# Altium schematic sheet Fuel_Gauge.SchDoc
size A4; SheetNumber: 1; SheetTotal: 2
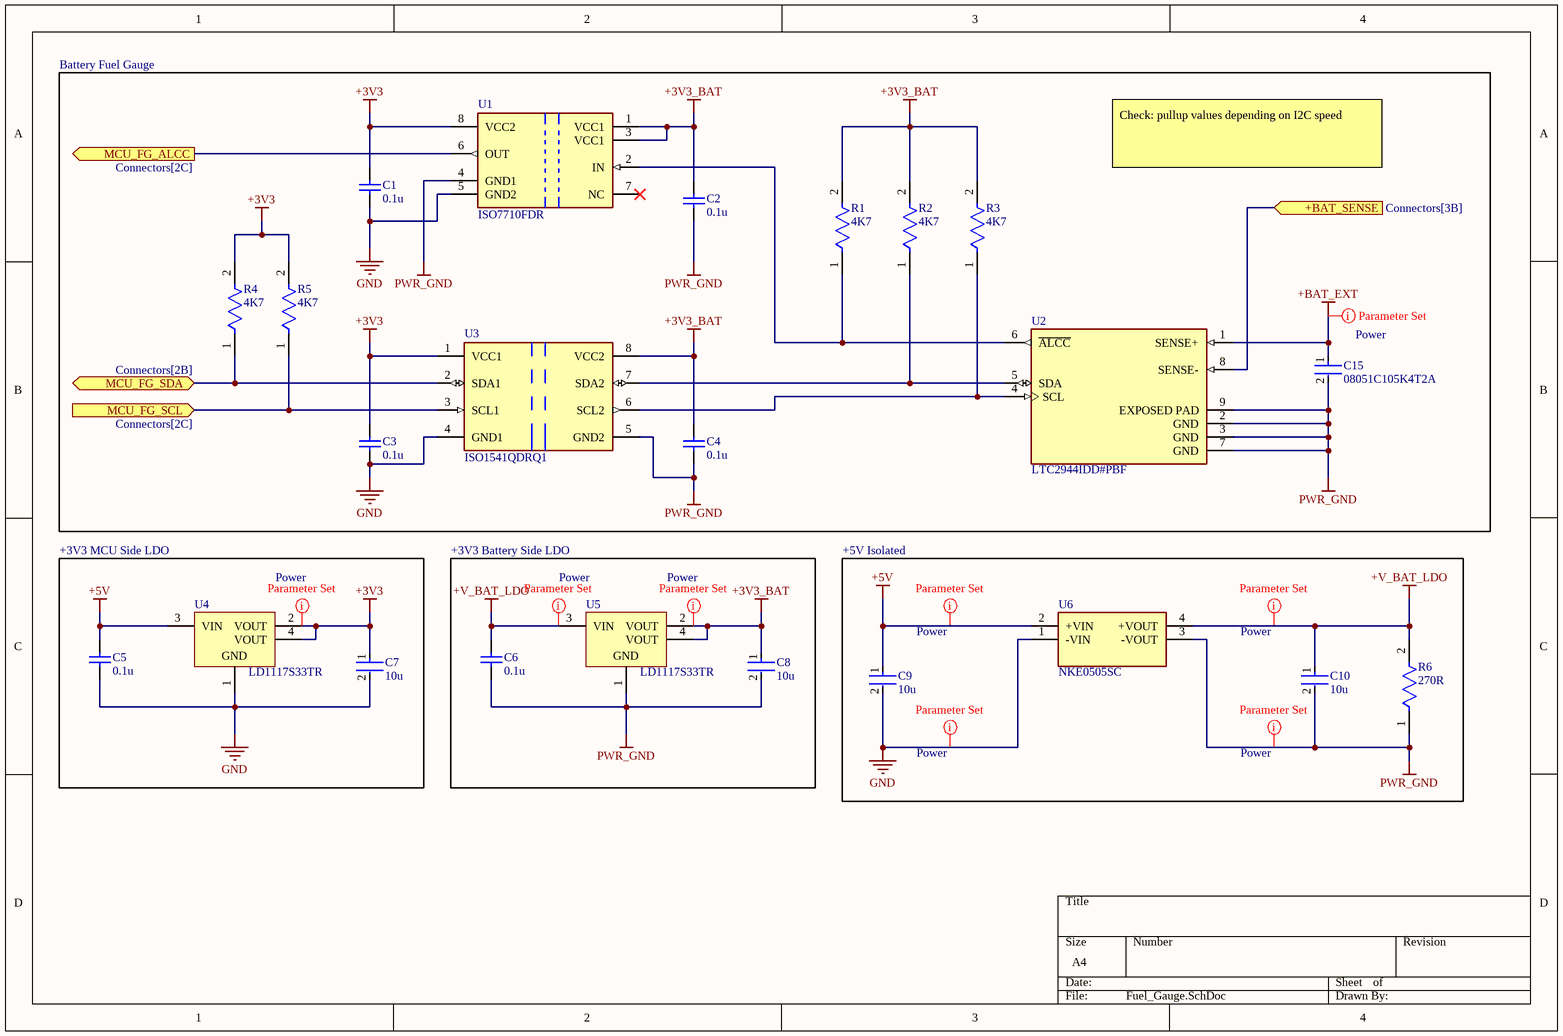
[diagram p0: Fuel_Gauge.SchDoc]

## Parts
C1  0.1u  [CAPC2013X145X48NL20T23]
C2  0.1u  [CAPC2013X145X48NL20T23]
C3  0.1u  [CAPC2013X145X48NL20T23]
C4  0.1u  [CAPC2013X145X48NL20T23]
C5  0.1u  [CAPC2013X145X48NL20T23]
C6  0.1u  [CAPC2013X145X48NL20T23]
C7  10u  [FP-CC1206-FD-MFG]
C8  10u  [FP-CC1206-FD-MFG]
C9  10u  [FP-CC1206-FD-MFG]
C10  10u  [FP-CC1206-FD-MFG]
C15  08051C105K4T2A  [FP-0805-L_2_01_0_2-W_1_25-MFG]
R1  4K7  [FP-RT0805-MFG]
R2  4K7  [FP-RT0805-MFG]
R3  4K7  [FP-RT0805-MFG]
R4  4K7  [FP-RT0805-MFG]
R5  4K7  [FP-RT0805-MFG]
R6  270R  [FP-AF1206-IPC_A]
U1  ISO7710FDR  [FP-D0008B-MFG]
U2  LTC2944IDD#PBF  [FP-DD-8-05-08-1698-MFG]
U3  ISO1541QDRQ1  [FP-D0008A-IPC_B]
U4  LD1117S33TR  [SOT-223_L]
U5  LD1117S33TR  [SOT-223_L]
U6  NKE0505SC  [FP-NKE-SIP-MFG]

## Blocks framed on the sheet
Battery Fuel Gauge: C1-C4 C15 R1-R5 U1-U3
+3V3 MCU Side LDO: C5 C7 U4
+3V3 Battery Side LDO: C6 C8 U5
+5V Isolated: C9 C10 R6 U6

## Ports
+BAT_SENSE (in, see Connectors[3B]), MCU_FG_ALCC (out, see Connectors[2C]), MCU_FG_SCL (in, see Connectors[2C]), MCU_FG_SDA (bidir, see Connectors[2B])

## Nets
+3V3: C1.2 C3.2 C7.1 R4.2 R5.2 U1.8(VCC2) U3.1(VCC1) U4.2(VOUT) U4.4(VOUT)
+3V3_BAT: C2.2 C4.2 C8.1 R1.2 R2.2 R3.2 U1.1(VCC1) U1.3(VCC1) U3.8(VCC2) U5.2(VOUT) U5.4(VOUT)
+5V: C5.2 C9.1 U4.3(VIN) U6.2(+VIN)
+BAT_EXT: C15.1 U2.1(SENSE+)
+V_BAT_LDO: C6.2 C10.1 R6.2 U5.3(VIN) U6.4(+VOUT)
GND: C1.1 C3.1 C5.1 C7.2 C9.2 U1.5(GND2) U3.4(GND1) U4.1(GND) U6.1(-VIN)
PWR_GND: C2.1 C4.1 C6.1 C8.2 C10.2 C15.2 R6.1 U1.4(GND1) U2.2(GND) U2.3(GND) U2.7(GND) U2.9(EXPOSED_PAD) U3.5(GND2) U5.1(GND) U6.3(-VOUT)
+BAT_SENSE: U2.8(SENSE-) ; port +BAT_SENSE
MCU_FG_ALCC: U1.6(OUT) ; port MCU_FG_ALCC
MCU_FG_SCL: R5.1 U3.3(SCL1) ; port MCU_FG_SCL
MCU_FG_SDA: R4.1 U3.2(SDA1) ; port MCU_FG_SDA
NetR1_1: R1.1 U1.2(IN) U2.6(~{ALCC})
NetR2_1: R2.1 U2.5(SDA) U3.7(SDA2)
NetR3_1: R3.1 U2.4(SCL) U3.6(SCL2)

Not connected (* = marked no-connect by the designer): U1 7(NC)*

## Layout directives
net class Power: +3V3, +3V3_BAT, +5V, +BAT_EXT, +V_BAT_LDO, GND, PWR_GND

## Notes on the sheet
- Check: pullup values depending on I2C speed

## Library data of the parts
C1-C6 = CMP-2007-01705-1: Part Number: VJ0805Y104KXAMR; Manufacturer: Vitramon
C7-C10 = CMP-03422-001420-1: CAP CER 10UF 50V X5R 1206; Tolerance: 10%; Voltage Rating (DC): 50V; Width: 0.063inch; Halogen Free: Halogen Free; Mount: Surface Mount; Dielectric: X5R; Max Operating Temperature: 85°C; Capacitance: 10uF; Case/Package: 1206; Voltage Rating: 50V; Lead Free: Lead Free; Thickness: 0.075inch; Min Operating Temperature: -55°C; Length: 0.126inch; Packaging: Tape and Reel; RoHS Compliant: Yes
C15 = CMP-07738-122049624-1: 08051C105K4T2A Cap Ceramic 1uF 100V X7R 10% Pad SMD 0805 125C Automotive T/R; Capacitance: 1µF; Tolerance: 10%; Dielectric: X7R; Case/Package: 0805; Material: Ceramic; Height: 1.4mm; Voltage Rating (DC): 100V; Voltage Rating: 100V; Schedule B: 8532240020; NexarPartId: 122049624; RoHS: Compliant; Lifecycle Status: Production; Min Operating Temperature: -55°C; Max Operating Temperature: 125°C
R1-R5 = CMP-03412-025396-1: RT0805 4.7KΩ 0.125W 50 ppm/°C 0.01%; Manufacturer: Yageo; Manufacturer Part Number: RT0805FRE134K7L; Tolerance: 0.0001; Voltage Rating: 150V; Category: Res; Footprint Url: http://www.yageo.com/exep/pages/download/literatures/PYu-R_Mount_10.pdf; Resistance: 4.7KΩ; Package: RT0805; Composition: Thin Film; Device Class L3: Chip SMD Resistors; Ipc Land Pattern Name: RESC200125X50; Temperature Range Low: -55°C; Lead Free: Yes; Temperature Range High: +155°C; Temperature Coefficient: 50 ppm/°C; Octopart: https://octopart.com/rt0805fre134k7l-yageo-16262042; ComponentLink2URL: http://www.yageo.com/documents/recent/PYu-RT_1-to-0.01_RoHS_L_9.pdf; Device Class L1: Passive Components; Value: 4.7KΩ; Automotive: No; Height: 0.6mm; Device Class L2: Resistors; RoHS: TRUE; Power Rating: 0.125W; Temperature: -55°C to +155°C; Series: RT; ComponentLink2Description: Datasheet
R6 = CMP-03412-047403-1: Anti-Sulfurated Chip Resistor Automotive Grade 270Ω 5% 0.25W ±100ppm/°C 1206
U1 = CMP-04872-000020-1: DGTL ISO 3000VRMS 1CH GP 8SOIC; Number of Channels: 1; Min Operating Temperature: -55°C; Max Operating Temperature: 125°C
U2 = CMP-09132-000003-1: IC BATTERY GAS GAUGE I2C 8DFN; Manufacturer: Analog Devices; Nominal Supply Current: 15-850uA; Max Supply Voltage: 60V; Number Of Cells: 1; Standoff Height: 0mm; Min Supply Voltage: 3.6V; Package: DD-8-05-08-1698; Mouser Description: LTC2944 - 60V Battery Gas Gauge with Temperature, Voltage and Current Measurement; Digikey Description: IC BATTERY GAS GAUGE I2C 8DFN; Device Class L1: Integrated Circuits (ICs); Automotive: No; Height: 0.8mm; Temperature: -40°C to +85°C; ComponentLink2Description: Datasheet; Number Of Outputs: 1; Octopart: https://octopart.com/ltc2944idd%23pbf-analog+devices-88318751; Ipc Land Pattern Name: DFN300X300X75-8; Temperature Range Low: -40°C; Lead Free: Yes; ComponentLink2URL: https://www.analog.com/media/en/technical-documentation/data-sheets/2944fa.pdf; Ambient Temperature Range Low: -40°C; Device Class L3: Battery Management; Category: IC; RoHS: TRUE; Manufacturer Part Number: LTC2944IDD#PBF; Ambient Temperature Range High: +85°C; Temperature Range High: +85°C; Device Class L2: Power Management ICs
U3 = CMP-04872-000096-1: AUTO ISO I2C 2500VRMS 2CH 8SOIC; Data Rate: 1Mbps; Number of Channels: 2; Working Voltage: 560V; Channel Type: Bidirectional; Pulse Width Distortion (PWD): 21ns; Isolated Power: No; Mount: Surface Mount; Max Operating Temperature: 125°C; Min Operating Temperature: -40°C; Packaging: Cut Tape; RoHS Compliant: Yes; Case/Package: SOIC; Number of Pins: 8
U4 U5 = CMP-0244-00310-1: Fixed Low Drop Positive Voltage Regulator, 3.3V, 4-Pin SOT-223, Tape and Reel; ComponentLink2Description: Datasheet; PackageDescription: 4-Pin SOT-223 Package, 6.5 x 3.5 mm Body, 2.3 mm Pitch, 7 mm Lead Span; PackageVersion: 2010; ComponentLink2URL: http://www.st.com/internet/com/TECHNICAL_RESOURCES/TECHNICAL_LITERATURE/DATASHEET/CD00000544.pdf; PackageReference: SOT-223; DatasheetVersion: 1/11/2011; ComponentLink1Description: Manufacturer URL; ComponentLink1URL: http://www.st.com
U6 = CMP-20596-000001-1: DC DC CONVERTER 12V 1W; Manufacturer: Murata Power Solutions Inc; Manufacturer Part Number: NKE1212SC; Switching Frequency: 115kHz; Output Type: Fixed; Min Supply Voltage: 10.8V; Switching Topology: Boost; Standoff Height: 0.4mm; Nominal Supply Current: 105mA; Output Current: 83mA; Max Supply Voltage: 13.2V; Number Of Outputs: 1; Device Class L3: Voltage Regulators - Switching; Max Power Dissipation: 1W; ComponentLink2Description: Datasheet; RoHS: TRUE; Category: IC; Digikey Description: DC DC CONVERTER 12V 1W; Lead Free: Yes; Octopart: https://octopart.com/nke1212sc-murata+power+solutions-49448374; Device Class L2: Power Management ICs; Temperature Range Low: -40°C; Height: 7.71mm; ComponentLink2URL: https://power.murata.com/pub/data/power/ncl/kdc_nke.pdf; Package: NKE-SIP; Device Class L1: Integrated Circuits (ICs); Mouser Description: Isolated DC/DC Converters 1W SNGL OUT 12-12V Single Output; Output Voltage: 12V; Automotive: No; Temperature: -40°C to +85°C; Temperature Range High: +85°C